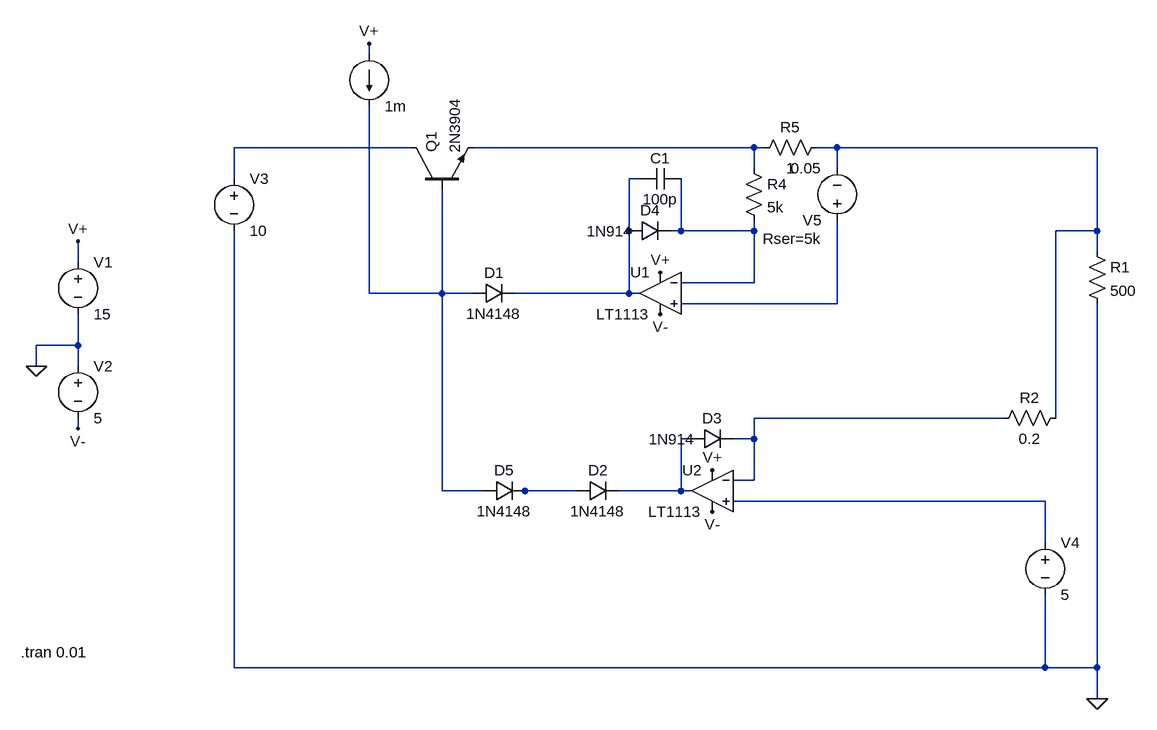
[diagram p0: schematic blackdog_experiments.asc]
blackdog_experiments.asc, the LTspice schematic file:
Version 4
SHEET 1 1468 1220
WIRE 144 -272 144 -288
WIRE 208 -128 -64 -128
WIRE 736 -128 304 -128
WIRE 752 -128 736 -128
WIRE 864 -128 832 -128
WIRE 1264 -128 864 -128
WIRE 736 -96 736 -128
WIRE 864 -96 864 -128
WIRE -64 -80 -64 -128
WIRE 560 -80 544 -80
WIRE 544 0 544 -80
WIRE 624 0 624 -80
WIRE 624 0 608 0
WIRE 736 0 736 -16
WIRE 736 0 624 0
WIRE 1264 0 1264 -128
WIRE 1264 0 1200 0
WIRE 1264 32 1264 0
WIRE -304 48 -304 16
WIRE 736 80 736 0
WIRE 736 80 624 80
WIRE 144 96 144 -192
WIRE 256 96 256 -64
WIRE 256 96 144 96
WIRE 304 96 256 96
WIRE 544 96 544 0
WIRE 544 96 368 96
WIRE 560 96 544 96
WIRE 864 112 864 -16
WIRE 864 112 624 112
WIRE -304 176 -304 128
WIRE -304 176 -368 176
WIRE -368 208 -368 176
WIRE -304 208 -304 176
WIRE 1120 288 736 288
WIRE 1200 288 1200 0
WIRE -304 304 -304 288
WIRE 640 320 624 320
WIRE 736 320 736 288
WIRE 736 320 704 320
WIRE 736 384 736 320
WIRE 736 384 704 384
WIRE 256 400 256 96
WIRE 320 400 256 400
WIRE 384 400 368 400
WIRE 464 400 384 400
WIRE 624 400 624 320
WIRE 624 400 528 400
WIRE 640 400 624 400
WIRE 1184 416 704 416
WIRE 1184 480 1184 416
WIRE -64 672 -64 0
WIRE 1184 672 1184 560
WIRE 1184 672 -64 672
WIRE 1264 672 1264 112
WIRE 1264 672 1184 672
WIRE 1264 720 1264 672
FLAG -368 208 0
FLAG -304 16 V+
FLAG -304 304 V-
FLAG 144 -288 V+
FLAG 1264 720 0
FLAG 592 64 V+
FLAG 672 368 V+
FLAG 672 432 V-
FLAG 592 128 V-
SYMBOL voltage -304 32 R0
WINDOW 123 0 0 Left 0
WINDOW 39 0 0 Left 0
SYMATTR InstName V1
SYMATTR Value 15
SYMBOL voltage -304 192 R0
WINDOW 123 0 0 Left 0
WINDOW 39 0 0 Left 0
SYMATTR InstName V2
SYMATTR Value 5
SYMBOL Opamps\\LT1113 592 32 M0
SYMATTR InstName U1
SYMBOL Opamps\\LT1113 672 336 M0
SYMATTR InstName U2
SYMBOL npn 208 -64 R270
SYMATTR InstName Q1
SYMATTR Value 2N3904
SYMBOL voltage -64 -96 R0
WINDOW 123 0 0 Left 0
WINDOW 39 0 0 Left 0
SYMATTR InstName V3
SYMATTR Value 10
SYMBOL current 144 -272 R0
WINDOW 123 0 0 Left 0
WINDOW 39 0 0 Left 0
SYMATTR Value 1m
SYMBOL diode 464 416 R270
WINDOW 0 32 32 VTop 2
WINDOW 3 0 32 VBottom 2
SYMATTR InstName D2
SYMATTR Value 1N4148
SYMBOL res 1248 16 R0
SYMATTR InstName R1
SYMATTR Value 500
SYMBOL voltage 1184 464 R0
WINDOW 123 0 0 Left 0
WINDOW 39 0 0 Left 0
SYMATTR InstName V4
SYMATTR Value 5
SYMBOL diode 640 336 R270
WINDOW 0 32 32 VTop 2
WINDOW 3 31 -30 VBottom 2
SYMATTR InstName D3
SYMATTR Value 1N914
SYMBOL res 1216 272 R90
WINDOW 0 0 56 VBottom 2
WINDOW 3 32 56 VTop 2
SYMATTR InstName R2
SYMATTR Value 0.2
SYMBOL res 720 -112 R0
SYMATTR InstName R4
SYMATTR Value 5k
SYMBOL voltage 864 0 R180
WINDOW 123 0 0 Left 0
WINDOW 39 24 -12 Left 2
SYMATTR SpiceLine Rser=5k
SYMATTR InstName V5
SYMATTR Value 0.05
SYMBOL diode 544 16 R270
WINDOW 0 32 32 VTop 2
WINDOW 3 31 -30 VBottom 2
SYMATTR InstName D4
SYMATTR Value 1N914
SYMBOL cap 624 -96 R90
WINDOW 0 0 32 VBottom 2
WINDOW 3 32 32 VTop 2
SYMATTR InstName C1
SYMATTR Value 100p
SYMBOL res 848 -144 R90
WINDOW 0 0 56 VBottom 2
WINDOW 3 32 56 VTop 2
SYMATTR InstName R5
SYMATTR Value 1
SYMBOL diode 304 112 R270
WINDOW 0 32 32 VTop 2
WINDOW 3 0 32 VBottom 2
SYMATTR InstName D1
SYMATTR Value 1N4148
SYMBOL diode 320 416 R270
WINDOW 0 32 32 VTop 2
WINDOW 3 0 32 VBottom 2
SYMATTR InstName D5
SYMATTR Value 1N4148
TEXT -392 648 Left 2 !.tran 0.01

The netlist it stands for:
* blackdog_experiments.asc
V1 V+ 0 15
V2 0 V- 5
XU1 N007 N005 V+ V- N004 LT1113  ; pins In+ In- V+ V- OUT
XU2 N011 N008 V+ V- N009 LT1113  ; pins In+ In- V+ V- OUT
Q1 N001 N006 N002 0 2N3904
V3 N001 0 10
I§? V+ N006 1m
D2 N010 N009 1N4148
R1 N003 0 500
V4 N011 0 5
D3 N009 N008 1N914
R2 N003 N008 0.2
R4 N002 N005 5k
V5 N007 N003 0.05 Rser=5k
D4 N004 N005 1N914
C1 N005 N004 100p
R5 N003 N002 1
D1 N006 N004 1N4148
D5 N006 N010 1N4148
.model D D
.lib standard.dio
.model NPN NPN
.model PNP PNP
.lib standard.bjt
.tran 0.01
.backanno
.end